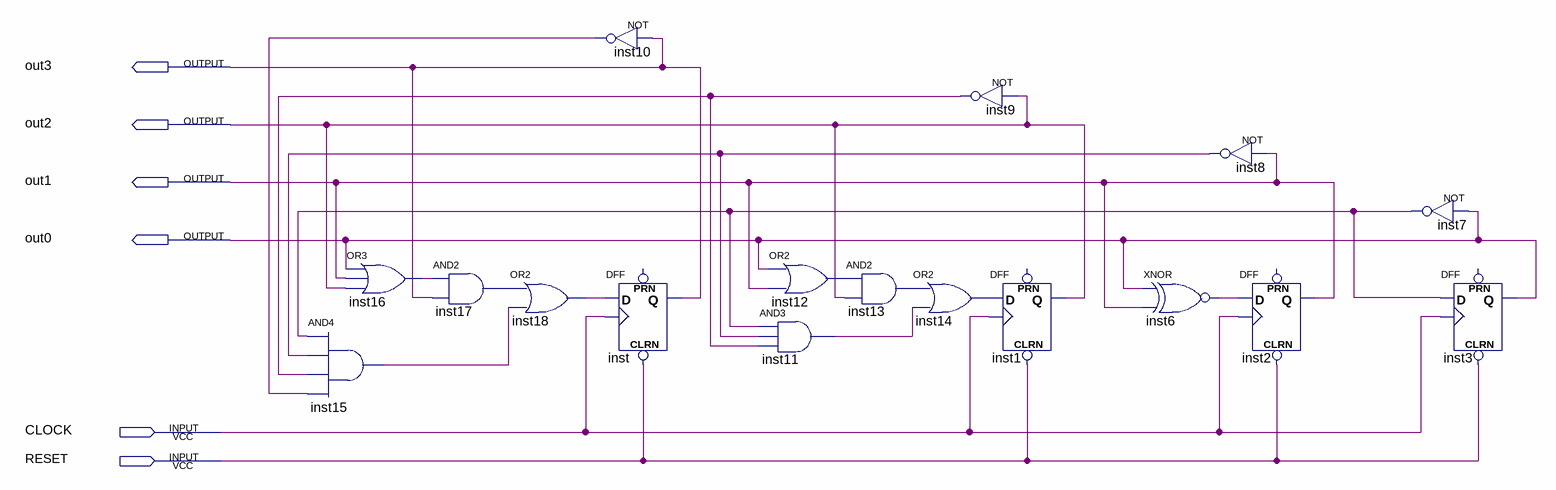
[diagram p0: schematic sheet]
// Quartus schematic count_down_schematic.bdf as structural Verilog: 17 symbols, 6 pins
module count_down_schematic (
  input  CLOCK,
  input  RESET,
  output out3,
  output out2,
  output out1,
  output out0
);

  wire inst6_out, inst7_out, inst8_out, inst9_out, inst10_out, inst11_out, inst12_out, inst13_out,
       inst14_out, inst15_out, inst16_out, inst17_out, inst18_out;

  and inst15 (inst15_out, inst7_out, inst8_out, inst9_out, inst10_out);
  or inst16 (inst16_out, out0, out1, out2);
  and inst17 (inst17_out, inst16_out, out3);
  or inst18 (inst18_out, inst17_out, inst15_out);
  not inst10 (inst10_out, out3);
  DFF inst (.CLRN(RESET), .CLK(CLOCK), .D(inst18_out), .Q(out3));  // open: PRN
  or inst12 (inst12_out, out0, out1);
  and inst11 (inst11_out, inst7_out, inst8_out, inst9_out);
  and inst13 (inst13_out, inst12_out, out2);
  or inst14 (inst14_out, inst13_out, inst11_out);
  not inst9 (inst9_out, out2);
  DFF inst1 (.CLRN(RESET), .CLK(CLOCK), .D(inst14_out), .Q(out2));  // open: PRN
  xnor inst6 (inst6_out, out0, out1);
  not inst8 (inst8_out, out1);
  DFF inst2 (.CLRN(RESET), .CLK(CLOCK), .D(inst6_out), .Q(out1));  // open: PRN
  not inst7 (inst7_out, out0);
  DFF inst3 (.CLRN(RESET), .CLK(CLOCK), .D(inst7_out), .Q(out0));  // open: PRN
endmodule
